# EasyEDA schematic SCH_FARM_2023-08-20.json
TITLE: Sheet_1; REV: 1.0; Date: 2023-07-17; Sheet: 1/1; Drawn By: vietquocvu5112002; Company: Your Company
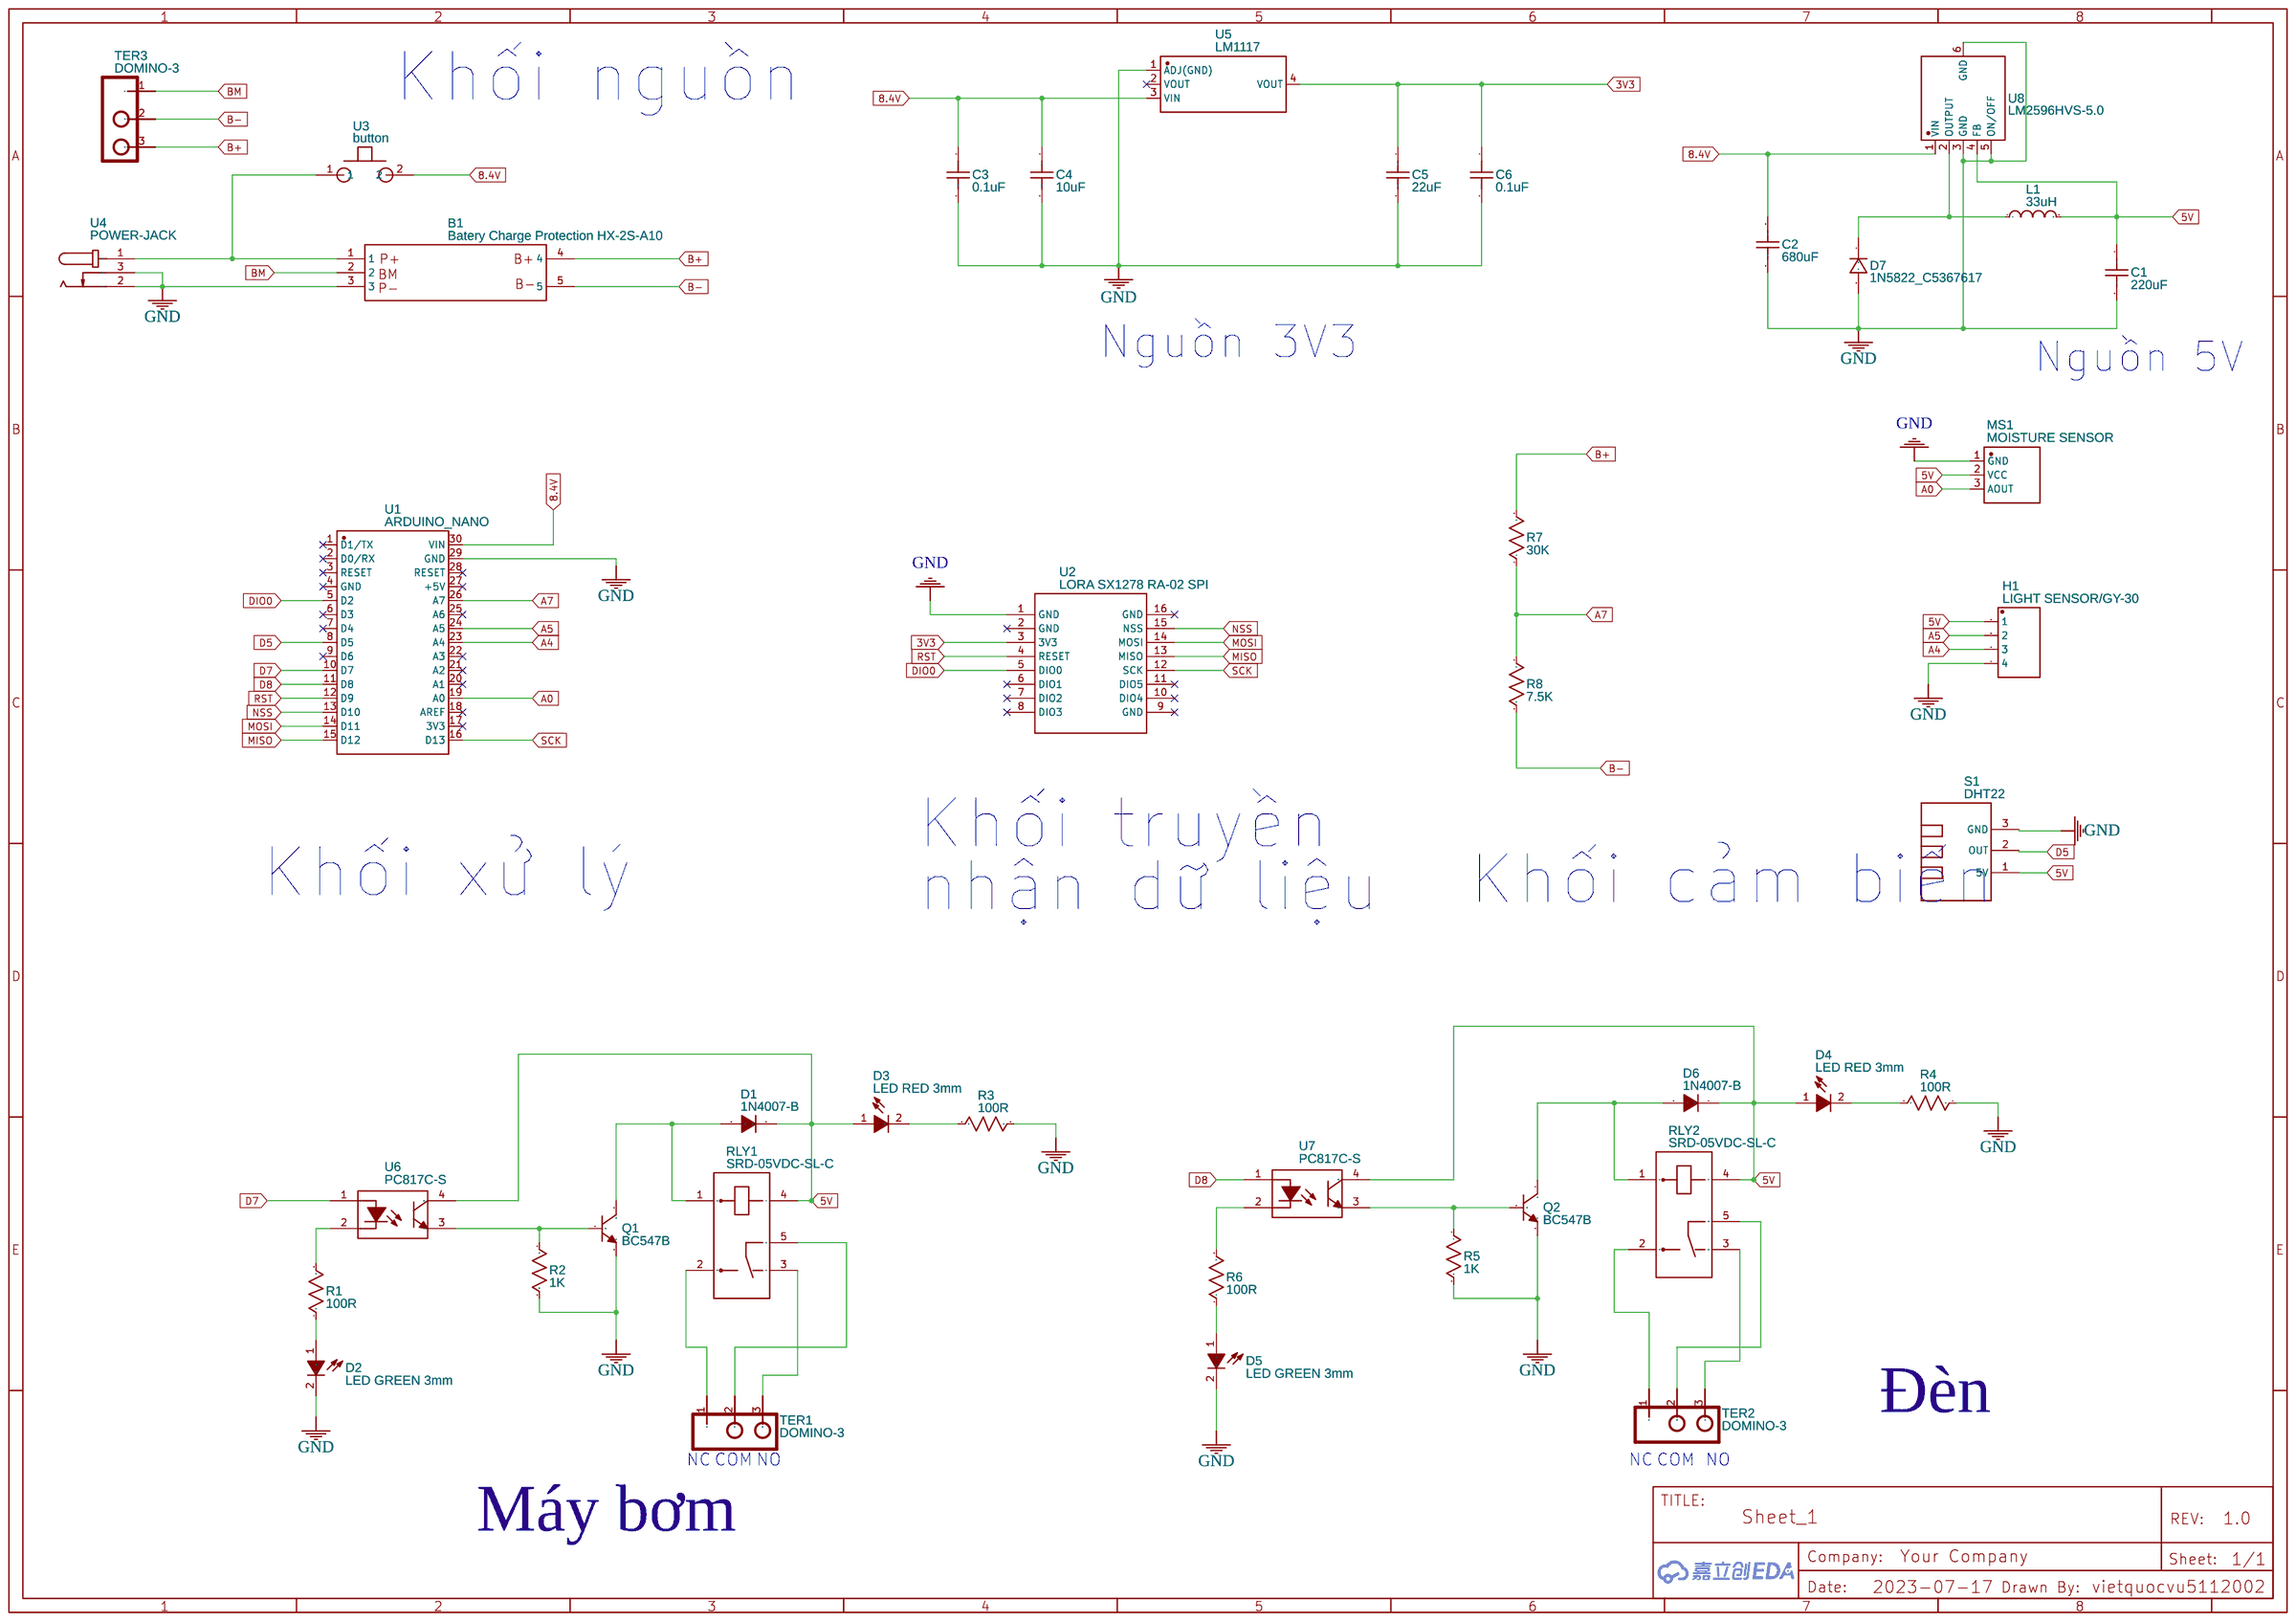
[diagram p0: schematic sheet]

## Parts
B1  Batery Charge Protection HX-2S-A10  [HX-2S-A10]
C1  220uF  [C0805]
C2  680uF  [C0805]
C3  0.1uF  [C0805]
C4  10uF  [C0805]
C5  22uF  [C0805]
C6  0.1uF  [C0805]
D1  1N4007-B  [1N4007FLTR]
D2  LED GREEN 3mm  [LED0805-R-RD]
D3  LED RED 3mm  [LED0805-R-RD]
D4  LED RED 3mm  [LED0805-R-RD]
D5  LED GREEN 3mm  [LED0805-R-RD]
D6  1N4007-B  [1N4007FLTR]
D7  1N5822_C5367617  [DO-27_BD5.3-L8.4-P12.40-D1.3-RD]
H1  LIGHT SENSOR/GY-30  [GY-30]
L1  33uH  [L0805]
MS1  MOISTURE SENSOR  [MOISTURE SENSOR]
Q1  BC547B  [TO-92-3_L4.9-W3.7-P1.27-L]
Q2  BC547B  [TO-92-3_L4.9-W3.7-P1.27-L]
R1  100R  [R0805]
R2  1K  [R0805]
R3  100R  [R0805]
R4  100R  [R0805]
R5  1K  [R0805]
R6  100R  [R0805]
R7  30K  [R0805]
R8  7.5K  [R0805]
RLY1  SRD-05VDC-SL-C  [RELAY-TH_SRD-XXVDC-XL-C]
RLY2  SRD-05VDC-SL-C  [RELAY-TH_SRD-XXVDC-XL-C]
S1  DHT22  [DHT22]
TER1  DOMINO-3  [DOMINO-3]
TER2  DOMINO-3  [DOMINO-3]
TER3  DOMINO-3  [DOMINO POWER PIN 2S]
U1  ARDUINO_NANO  [COMM-TH_ARDUINO_NANO]
U2  LORA SX1278 RA-02 SPI  [LORA SX1278 RA-02 DIP 01]
U3  button  [SW-TH_MTS-102]
U4  POWER-JACK  [DC-IN-TH_POWER-JACK]
U5  LM1117  [SOT-223-3_L6.5-W3.4-P2.30-LS7.0-BR]
U6  PC817C-S  [SOP-4_L6.5-W4.6-P2.54-LS10.3-TL]
U7  PC817C-S  [SOP-4_L6.5-W4.6-P2.54-LS10.3-TL]
U8  LM2596HVS-5.0  [TO-263-5_L10.2-W8.9-P1.70-BR]

## Library data of the parts
B1 = Batery Charge Protection HX-2S-A10: Contributor: VicenteOliverio
C1-C6 = C_0603_US: Contributor: LCEDA_Lib
D1 D6 = 1N4007-B: Supplier: LCSC; Supplier Part: C526198; Manufacturer: Diodes Incorporated; Contributor: LCSC; JLCPCB Part Class: Extended Part
D2-D5 = 3mm Green TH LED 5600: Supplier: Digi-Key; Manufacturer: VccLite; Manufacturer Part: 5600; Supplier Part: L20325-ND; link: https://vcclite.com/product/5602f5-5v/; Contributor: raihan22tet
D7 = 1N5822_C5367617: Supplier: LCSC; Supplier Part: C5367617; Manufacturer: SY(顺烨）; Manufacturer Part: 1N5822; link: https://atta.szlcsc.com/upload/public/pdf/source/20230315/195420E45297E2182A99B05A1FF95EBE.pdf; Contributor: lcsc
H1 = Header-Male-2.54_1x4: Supplier: LCSC; Manufacturer: Ckmtw(灿科盟); Manufacturer Part: B-2100S04P-A110; Contributor: LCSC; Supplier Part: C124378; JLCPCB Part Class: Extended Part
L1 = L0603_US: Contributor: LCEDA_Lib
MS1 = MOISTURE SENSOR: Contributor: vietquocvu5112002
Q1 Q2 = BC547B: Supplier: LCSC; Supplier Part: C713613; Manufacturer: LGE(鲁光); Contributor: LCSC; JLCPCB Part Class: Extended Part
R1-R8 = R_0603_US: Contributor: LCEDA_Lib
RLY1 RLY2 = SRD-05VDC-SL-C: Supplier: LCSC; Manufacturer: 松乐; Supplier Part: C35449; JLCPCB Part Class: Extended Part
S1 = DHT22: Contributor: vietquocvu5112002
TER1-TER3 = DOMINO-3: Contributor: hkshks1
U1 = ARDUINO_NANO: Supplier: LCSC; Supplier Part: C9900017879; Manufacturer: null; JLCPCB Part Class: Extended Part; Contributor: lcsc
U2 = LORA SX1278 RA-02 DIP 01: Contributor: rhalfcaacbay
U3 = button: catid: 20; Contributor: visal; sim: true
U4 = POWER-JACK: Supplier: LCSC; Supplier Part: C9900001795; Manufacturer: null; JLCPCB Part Class: Extended Part; Contributor: LCSC
U5 = AMS1117-ADJ_C2891840: Supplier: LCSC; Supplier Part: C2891840; Manufacturer: YONGYUTAI(永裕泰); Manufacturer Part: AMS1117-ADJ; Contributor: LCSC; JLCPCB Part Class: Extended Part
U6 U7 = PC817C-S: Supplier: LCSC; Supplier Part: C3008369; Manufacturer: UMW(广东友台半导体); link: https://atta.szlcsc.com/upload/public/pdf/source/20220426/D9D4F16FD03F9B6A371B29B6E9F939A1.pdf; Contributor: lcsc; JLCPCB Part Class: Extended Part
U8 = LM2596HVS-5.0: Supplier: LCSC; Supplier Part: C434497; Manufacturer: HGSEMI(华冠); Contributor: LCSC; JLCPCB Part Class: Extended Part

## Nets
3V3: C5.1 C6.1 U2.3(3V3) U5.4(VOUT)
5V: C1.1 D1.1(K) D3.1(A) D4.1(A) D6.1(K) H1.1 L1.2 MS1.2(VCC) RLY1.4 RLY2.4 S1.1(5V) U6.4(COL) U7.4(COL) U8.4(FB)
8.4V: C2.1 C3.1 C4.1 U1.30(VIN) U3.2 U5.3(VIN) U8.1(VIN)
GND: B1.3 C1.2 C2.2 C3.2 C4.2 C5.2 C6.2 D2.2(K) D5.2(K) D7.2(A) H1.4 MS1.1(GND) Q1.3(E) Q2.3(E) R2.2 R3.1 R4.1 R5.2 S1.3(GND) U1.29(GND) U2.1(GND) U4.2 U4.3 U5.1(ADJ(GND)) U8.3(GND) U8.5(ON/OFF) U8.6(GND)
A0: MS1.3(AOUT) U1.19(A0)
A4: H1.3 U1.23(A4)
A5: H1.2 U1.24(A5)
A7: R7.1 R8.2 U1.26(A7)
B+: B1.4 R7.2 TER3.3
B-: B1.5 R8.1 TER3.2
BM: B1.2 TER3.1
D5: S1.2(OUT) U1.8(D5)
D7: U1.10(D7) U6.1(AN)
D8: U1.11(D8) U7.1(AN)
DIO0: U1.5(D2) U2.5(DIO0)
MISO: U1.15(D12) U2.13(MISO)
MOSI: U1.14(D11) U2.14(MOSI)
NSS: U1.13(D10) U2.15(NSS)
RST: U1.12(D9) U2.4(RESET)
SCK: U1.16(D13) U2.12(SCK)
Net-(B1-1): B1.1 U3.1 U4.1
Net-(D1-2): D1.2(A) Q1.1(C) RLY1.1
Net-(D2-1): D2.1(A) R1.1
Net-(D3-2): D3.2(K) R3.2
Net-(D4-2): D4.2(K) R4.2
Net-(D5-1): D5.1(A) R6.1
Net-(D6-2): D6.2(A) Q2.1(C) RLY2.1
Net-(D7-1): D7.1(C) L1.1 U8.2(OUTPUT)
Net-(Q1-2): Q1.2(B) R2.1 U6.3(EM)
Net-(Q2-2): Q2.2(B) R5.1 U7.3(EM)
Net-(R1-2): R1.2 U6.2(CAT)
Net-(R6-2): R6.2 U7.2(CAT)
Net-(RLY1-2): RLY1.2 TER1.1
Net-(RLY1-3): RLY1.3 TER1.3
Net-(RLY1-5): RLY1.5 TER1.2
Net-(RLY2-2): RLY2.2 TER2.1
Net-(RLY2-3): RLY2.3 TER2.3
Net-(RLY2-5): RLY2.5 TER2.2

Not connected (* = marked no-connect by the designer): U1 1(D1/TX)* 2(D0/RX)* 3(RESET)* 4(GND)* 6(D3)* 7(D4)* 9(D6)* 17(3V3)* 18(AREF)* 20(A1)* 21(A2)* 22(A3)* 25(A6)* 27(+5V)* 28(RESET)*; U2 2(GND)* 6(DIO1)* 7(DIO2)* 8(DIO3)* 9(GND)* 10(DIO4)* 11(DIO5)* 16(GND)*; U5 2(VOUT)*

## Notes on the sheet
- Khối nguồn
- Nguồn 3V3
- Nguồn 5V
- Khối truyền
- Khối xử lý
- Khối cảm biến
- nhận dữ liệu
- Đèn
- NC
- COM
- NO
- NC
- COM
- NO
- Máy bơm
